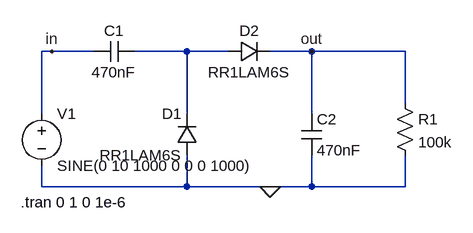
[diagram p0: schematic Draft3.asc]
Draft3.asc, the LTspice schematic file:
Version 4
SHEET 1 880 680
WIRE -64 112 -80 112
WIRE 0 112 -64 112
WIRE 144 112 64 112
WIRE 208 112 144 112
WIRE 336 112 272 112
WIRE 480 112 336 112
WIRE 480 192 480 112
WIRE -80 208 -80 112
WIRE 144 208 144 112
WIRE 336 208 336 112
WIRE -80 320 -80 288
WIRE 144 320 144 272
WIRE 144 320 -80 320
WIRE 272 320 144 320
WIRE 336 320 336 272
WIRE 336 320 272 320
WIRE 480 320 480 272
WIRE 480 320 336 320
FLAG 272 320 0
FLAG 336 112 out
FLAG -64 112 in
SYMBOL voltage -80 192 R0
WINDOW 123 0 0 Left 0
WINDOW 39 0 0 Left 0
SYMATTR InstName V1
SYMATTR Value SINE(0 10 1000 0 0 0 1000)
SYMBOL diode 160 272 R180
WINDOW 0 24 64 Left 2
WINDOW 3 24 0 Left 2
SYMATTR InstName D1
SYMATTR Value RR1LAM6S
SYMBOL diode 208 128 R270
WINDOW 0 32 32 VTop 2
WINDOW 3 0 32 VBottom 2
SYMATTR InstName D2
SYMATTR Value RR1LAM6S
SYMBOL cap 64 96 R90
WINDOW 0 0 32 VBottom 2
WINDOW 3 32 32 VTop 2
SYMATTR InstName C1
SYMATTR Value 470nF
SYMBOL cap 320 208 R0
SYMATTR InstName C2
SYMATTR Value 470nF
SYMBOL res 464 176 R0
SYMATTR InstName R1
SYMATTR Value 100k
TEXT -112 344 Left 2 !.tran 0 1 0 1e-6

The netlist it stands for:
* Draft3.asc
V1 in 0 SINE(0 10 1000 0 0 0 1000)
D1 0 N001 RR1LAM6S
D2 N001 out RR1LAM6S
C1 N001 in 470nF
C2 out 0 470nF
R1 out 0 100k
.model D D
.lib standard.dio
.tran 0 1 0 1e-6
.backanno
.end